# EAGLE schematic HydroSafeBattery (EAGLE 9.2.1)

## Sheet 1 of 3: Analog Front End (AFE)
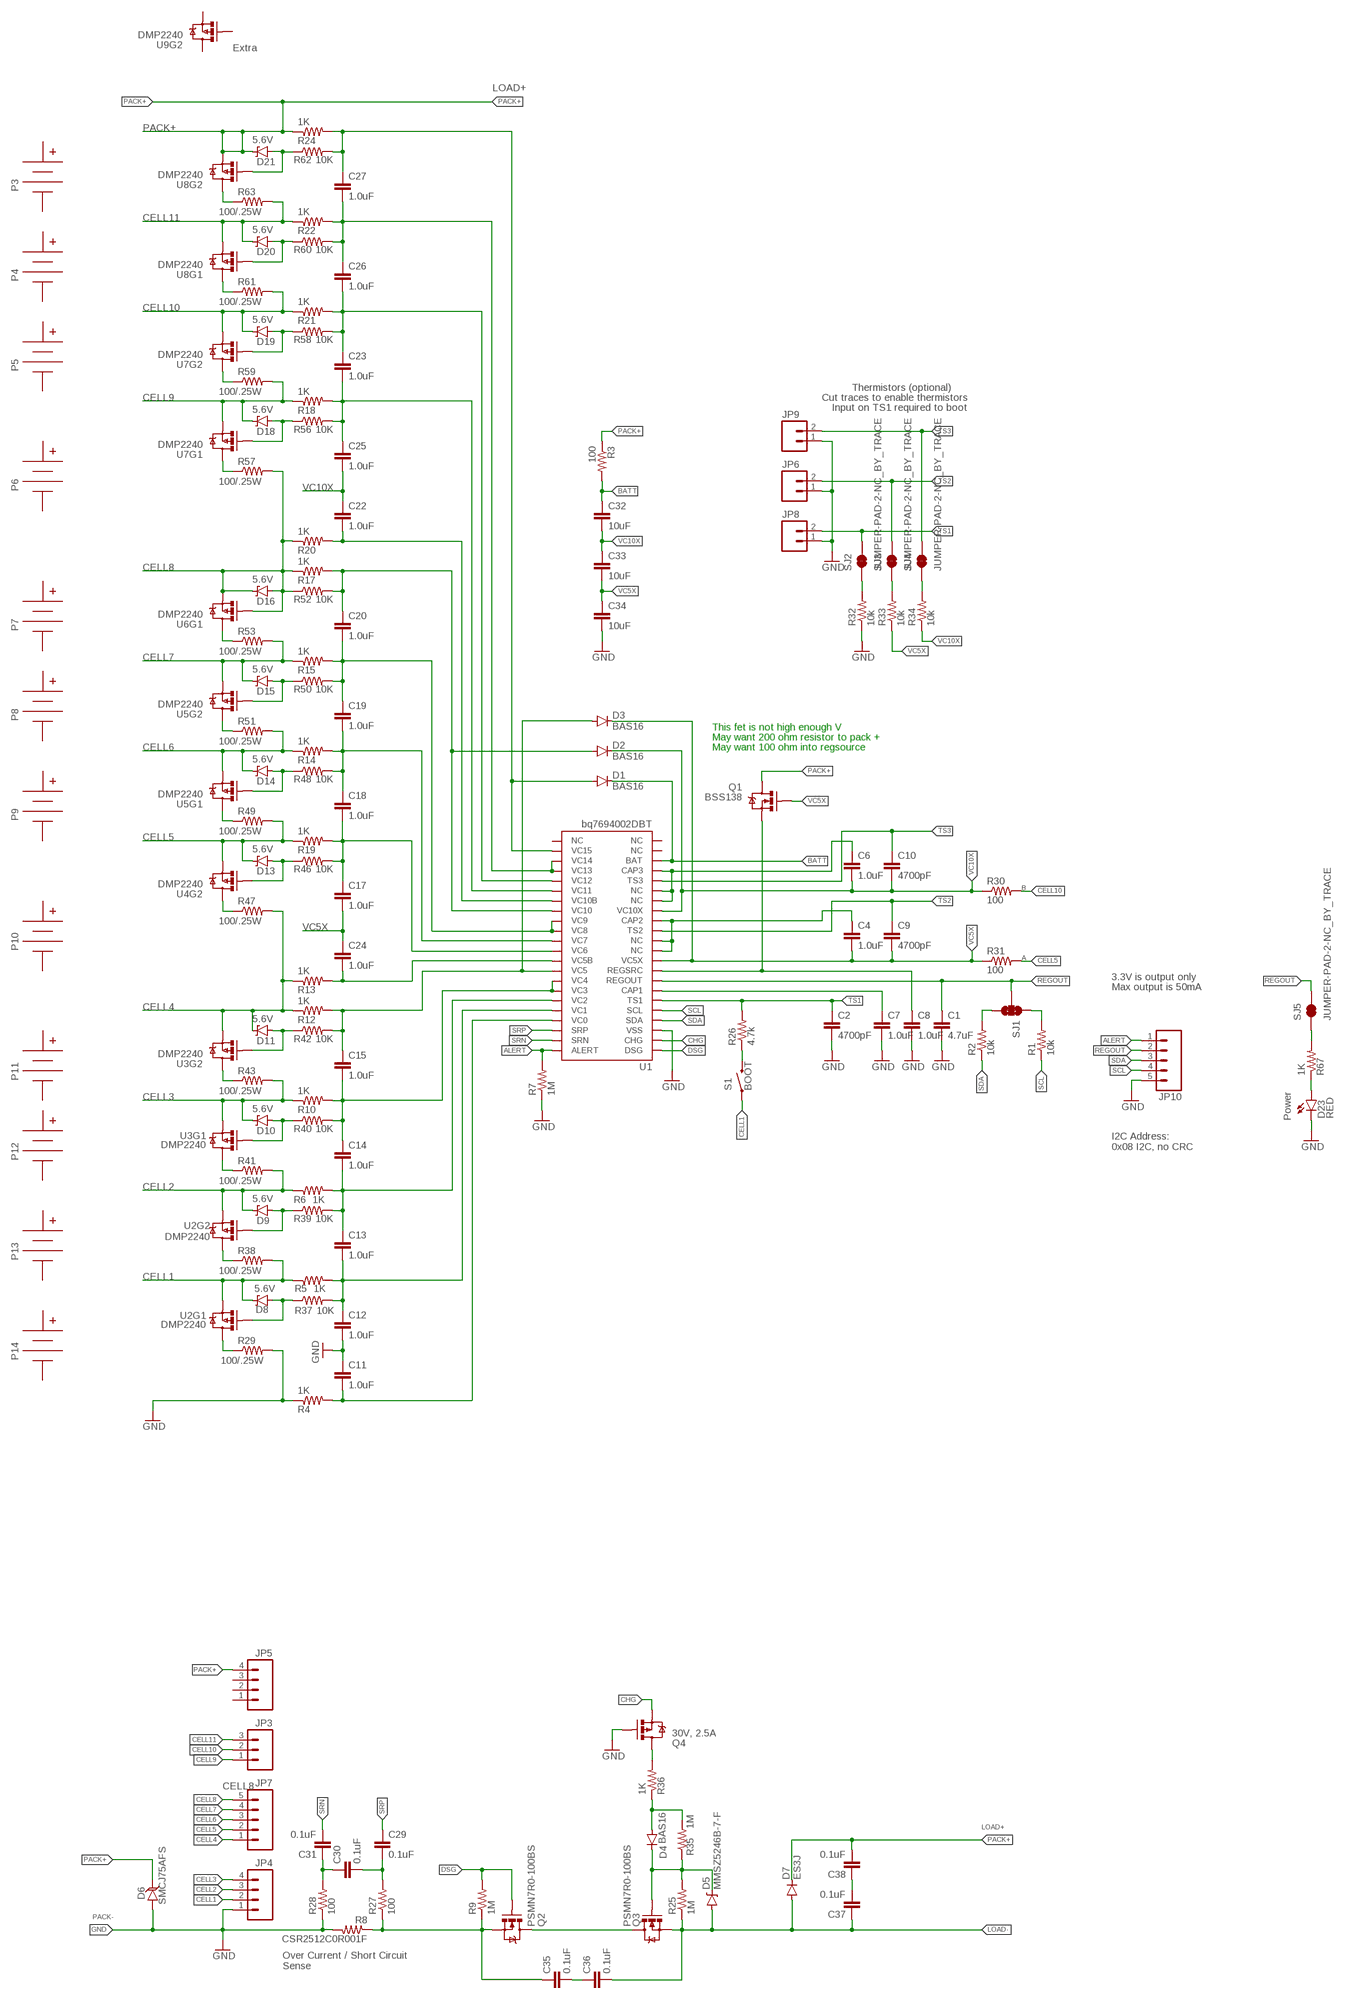
[diagram p0: schematic, sheet 1]

### Parts
C1  4.7uF  4.7UF-6.3V-10%(0603)0603  [0603-CAP@1]
C2  4700pF  4.7NF-50V-10%(0603)  [0603-CAP@1]
C4  1.0uF  1.0UF-16V-10%(0603)  [0603-CAP]
C6  1.0uF  1.0UF-16V-10%(0603)  [0603-CAP]
C7  1.0uF  1.0UF-16V-10%(0603)  [0603-CAP]
C8  1.0uF  1.0UF-16V-10%(0603)  [0603-CAP]
C9  4700pF  4.7NF-50V-10%(0603)  [0603-CAP@1]
C10  4700pF  4.7NF-50V-10%(0603)  [0603-CAP@1]
C11  1.0uF  1.0UF-16V-10%(0603)  [0603-CAP]
C12  1.0uF  1.0UF-16V-10%(0603)  [0603-CAP]
C13  1.0uF  1.0UF-16V-10%(0603)  [0603-CAP]
C14  1.0uF  1.0UF-16V-10%(0603)  [0603-CAP]
C15  1.0uF  1.0UF-16V-10%(0603)  [0603-CAP]
C17  1.0uF  1.0UF-16V-10%(0603)  [0603-CAP]
C18  1.0uF  1.0UF-16V-10%(0603)  [0603-CAP]
C19  1.0uF  1.0UF-16V-10%(0603)  [0603-CAP]
C20  1.0uF  1.0UF-16V-10%(0603)  [0603-CAP]
C22  1.0uF  1.0UF-16V-10%(0603)  [0603-CAP]
C23  1.0uF  1.0UF-16V-10%(0603)  [0603-CAP]
C24  1.0uF  1.0UF-16V-10%(0603)  [0603-CAP]
C25  1.0uF  1.0UF-16V-10%(0603)  [0603-CAP]
C26  1.0uF  1.0UF-16V-10%(0603)  [0603-CAP]
C27  1.0uF  1.0UF-16V-10%(0603)  [0603-CAP]
C29  0.1uF  0.1UF-25V(+80/-20%)(0603)  [0603-CAP@1]
C30  0.1uF  0.1UF-25V(+80/-20%)(0603)  [0603-CAP@1]
C31  0.1uF  0.1UF-25V(+80/-20%)(0603)  [0603-CAP@1]
C32  10uF  10UF50V20%(1210)  [1210]
C33  10uF  10UF50V20%(1210)  [1210]
C34  10uF  10UF50V20%(1210)  [1210]
C35  0.1uF  0.1UF-100V-10%(0603)  [0603-CAP@1]
C36  0.1uF  0.1UF-100V-10%(0603)  [0603-CAP@1]
C37  0.1uF  0.1UF-100V-10%(0603)  [0603-CAP@1]
C38  0.1uF  0.1UF-100V-10%(0603)  [0603-CAP@1]
D1  BAS16  DIODESOD  [SOD-323]
D2  BAS16  DIODESOD  [SOD-323]
D3  BAS16  DIODESOD  [SOD-323]
D4  BAS16  DIODESOD  [SOD-323]
D5  MMSZ5246B-7-F  DIODE-ZENERSOD-123  [SOD-123]
D6  SMCJ75AFS  TVSSMC  [SMC]
D7  ES3J  DIODESMC/DO-214AB  [SMC]
D8  5.6V  DIODE-ZENER3.3V  [SOD-323]
D9  5.6V  DIODE-ZENER3.3V  [SOD-323]
D10  5.6V  DIODE-ZENER3.3V  [SOD-323]
D11  5.6V  DIODE-ZENER3.3V  [SOD-323]
D13  5.6V  DIODE-ZENER3.3V  [SOD-323]
D14  5.6V  DIODE-ZENER3.3V  [SOD-323]
D15  5.6V  DIODE-ZENER3.3V  [SOD-323]
D16  5.6V  DIODE-ZENER3.3V  [SOD-323]
D18  5.6V  DIODE-ZENER3.3V  [SOD-323]
D19  5.6V  DIODE-ZENER3.3V  [SOD-323]
D20  5.6V  DIODE-ZENER3.3V  [SOD-323]
D21  5.6V  DIODE-ZENER3.3V  [SOD-323]
D23  RED  LED-RED1206  [LED-1206]
JP3  M03JST-PTH  [JST-3-PTH]
JP4  M04JST-PTH  [JST-4-PTH]
JP5  M04JST-PTH  [JST-4-PTH]
JP6  M02PTH  [1X02]
JP7  M05JST  [JST-5-PTH]
JP8  M02PTH  [1X02]
JP9  M02PTH  [1X02]
JP10  M05PTH  [1X05]
P3  18650_BAT_TRAY_SMD_NON_POLAR  [18650_BAT_TRAY_SMD_NON_POLAR]
P4  18650_BAT_TRAY_SMD_NON_POLAR  [18650_BAT_TRAY_SMD_NON_POLAR]
P5  18650_BAT_TRAY_SMD_NON_POLAR  [18650_BAT_TRAY_SMD_NON_POLAR]
P6  18650_BAT_TRAY_SMD_NON_POLAR  [18650_BAT_TRAY_SMD_NON_POLAR]
P7  18650_BAT_TRAY_SMD_NON_POLAR  [18650_BAT_TRAY_SMD_NON_POLAR]
P8  18650_BAT_TRAY_SMD_NON_POLAR  [18650_BAT_TRAY_SMD_NON_POLAR]
P9  18650_BAT_TRAY_SMD_NON_POLAR  [18650_BAT_TRAY_SMD_NON_POLAR]
P10  18650_BAT_TRAY_SMD_NON_POLAR  [18650_BAT_TRAY_SMD_NON_POLAR]
P11  18650_BAT_TRAY_SMD_NON_POLAR  [18650_BAT_TRAY_SMD_NON_POLAR]
P12  18650_BAT_TRAY_SMD_NON_POLAR  [18650_BAT_TRAY_SMD_NON_POLAR]
P13  18650_BAT_TRAY_SMD_NON_POLAR  [18650_BAT_TRAY_SMD_NON_POLAR]
P14  18650_BAT_TRAY_SMD_NON_POLAR  [18650_BAT_TRAY_SMD_NON_POLAR]
Q1  BSS138  MOSFET-NCHANNELBSS138  [SOT23-3]
Q2  PSMN7R0-100BS  MOSFET-NCHANNELPSMN7R0  [TO-263/D2PAK]
Q3  PSMN7R0-100BS  MOSFET-NCHANNELPSMN7R0  [TO-263/D2PAK]
Q4  30V, 2.5A  MOSFET-PCHANNELDMG2307L  [SOT23-3]
R1  10k  10KOHM1/10W1%(0603)0603  [0603-RES@1]
R2  10k  10KOHM1/10W1%(0603)0603  [0603-RES@1]
R3  100  100OHM1/10W1%(0603)  [0603-RES@1]
R4  1K  1KOHM1/10W1%(0603)  [0603-RES@1]
R5  1K  1KOHM1/10W1%(0603)  [0603-RES@1]
R6  1K  1KOHM1/10W1%(0603)  [0603-RES@1]
R7  1M  1MOHM1/10W1%(0603)  [0603-RES@1]
R8  CSR2512C0R001F  RESISTOR2512  [2512]
R9  1M  1MOHM1/10W1%(0603)  [0603-RES@1]
R10  1K  1KOHM1/10W1%(0603)  [0603-RES@1]
R12  1K  1KOHM1/10W1%(0603)  [0603-RES@1]
R13  1K  1KOHM1/10W1%(0603)  [0603-RES@1]
R14  1K  1KOHM1/10W1%(0603)  [0603-RES@1]
R15  1K  1KOHM1/10W1%(0603)  [0603-RES@1]
R17  1K  1KOHM1/10W1%(0603)  [0603-RES@1]
R18  1K  1KOHM1/10W1%(0603)  [0603-RES@1]
R19  1K  1KOHM1/10W1%(0603)  [0603-RES@1]
R20  1K  1KOHM1/10W1%(0603)  [0603-RES@1]
R21  1K  1KOHM1/10W1%(0603)  [0603-RES@1]
R22  1K  1KOHM1/10W1%(0603)  [0603-RES@1]
R24  1K  1KOHM1/10W1%(0603)  [0603-RES@1]
R25  1M  1MOHM1/10W1%(0603)  [0603-RES@1]
R26  4.7k  4.7KOHM1/10W1%(0603)  [0603-RES@1]
R27  100  100OHM1/10W1%(0603)  [0603-RES@1]
R28  100  100OHM1/10W1%(0603)  [0603-RES@1]
R29  100/.25W  100OHM1/10W1%(0603)  [0603-RES@1]
R30  100  100OHM1/10W1%(0603)  [0603-RES@1]
R31  100  100OHM1/10W1%(0603)  [0603-RES@1]
R32  10k  10KOHM1/10W1%(0603)0603  [0603-RES@1]
R33  10k  10KOHM1/10W1%(0603)0603  [0603-RES@1]
R34  10k  10KOHM1/10W1%(0603)0603  [0603-RES@1]
R35  1M  1MOHM1/10W1%(0603)  [0603-RES@1]
R36  1K  1KOHM1/10W1%(0603)  [0603-RES@1]
R37  10K  10KOHM1/10W1%(0603)0603  [0603-RES@1]
R38  100/.25W  100OHM1/10W1%(0603)  [0603-RES@1]
R39  10K  10KOHM1/10W1%(0603)0603  [0603-RES@1]
R40  10K  10KOHM1/10W1%(0603)0603  [0603-RES@1]
R41  100/.25W  100OHM1/10W1%(0603)  [0603-RES@1]
R42  10K  10KOHM1/10W1%(0603)0603  [0603-RES@1]
R43  100/.25W  100OHM1/10W1%(0603)  [0603-RES@1]
R46  10K  10KOHM1/10W1%(0603)0603  [0603-RES@1]
R47  100/.25W  100OHM1/10W1%(0603)  [0603-RES@1]
R48  10K  10KOHM1/10W1%(0603)0603  [0603-RES@1]
R49  100/.25W  100OHM1/10W1%(0603)  [0603-RES@1]
R50  10K  10KOHM1/10W1%(0603)0603  [0603-RES@1]
R51  100/.25W  100OHM1/10W1%(0603)  [0603-RES@1]
R52  10K  10KOHM1/10W1%(0603)0603  [0603-RES@1]
R53  100/.25W  100OHM1/10W1%(0603)  [0603-RES@1]
R56  10K  10KOHM1/10W1%(0603)0603  [0603-RES@1]
R57  100/.25W  100OHM1/10W1%(0603)  [0603-RES@1]
R58  10K  10KOHM1/10W1%(0603)0603  [0603-RES@1]
R59  100/.25W  100OHM1/10W1%(0603)  [0603-RES@1]
R60  10K  10KOHM1/10W1%(0603)0603  [0603-RES@1]
R61  100/.25W  100OHM1/10W1%(0603)  [0603-RES@1]
R62  10K  10KOHM1/10W1%(0603)0603  [0603-RES@1]
R63  100/.25W  100OHM1/10W1%(0603)  [0603-RES@1]
R67  1K  1KOHM1/10W1%(0603)  [0603-RES@1]
S1  BOOT  SWITCH-MOMENTARY-2-SMD-1101NE  [TACTILE-SWITCH-1101NE]
SJ1  JUMPER-PAD-3-NC_BY_TRACE  [PAD-JUMPER-3-3OF3_NC_BY_TRACE_YES_SILK_FULL_BOX]
SJ2  JUMPER-PAD-2-NC_BY_TRACE  [PAD-JUMPER-2-NC_BY_TRACE_YES_SILK]
SJ3  JUMPER-PAD-2-NC_BY_TRACE  [PAD-JUMPER-2-NC_BY_TRACE_YES_SILK]
SJ4  JUMPER-PAD-2-NC_BY_TRACE  [PAD-JUMPER-2-NC_BY_TRACE_YES_SILK]
SJ5  JUMPER-PAD-2-NC_BY_TRACE  [PAD-JUMPER-2-NC_BY_TRACE_YES_SILK]
U1  bq7694002DBT  BQ7694040  [44-TSSOP]
U2  DMP2240  MOSFET-PCHANNEL_DUALSOT26  [SOT26]
U3  DMP2240  MOSFET-PCHANNEL_DUALSOT26  [SOT26]
U4  DMP2240  MOSFET-PCHANNEL_DUALSOT26  [SOT26]
U5  DMP2240  MOSFET-PCHANNEL_DUALSOT26  [SOT26]
U6  DMP2240  MOSFET-PCHANNEL_DUALSOT26  [SOT26]
U7  DMP2240  MOSFET-PCHANNEL_DUALSOT26  [SOT26]
U8  DMP2240  MOSFET-PCHANNEL_DUALSOT26  [SOT26]
U9  DMP2240  MOSFET-PCHANNEL_DUALSOT26  [SOT26]

### Nets
ALERT: JP10.1 R7.2 U1.44(ALERT)
BATT: C32.1 D1.C R3.2 U1.20(BAT)
CAP2: C4.1 U1.11(NC) U1.12(NC) U1.14(CAP2)
CAP3: C6.1 U1.16(NC) U1.17(NC) U1.19(CAP3)
CELL1: D8.C JP4.2 R5.1 R38.2 S1.1 U2.S1(S)
CELL2: D9.C JP4.3 R6.1 R41.2 U2.S2(S)
CELL3: D10.C JP4.4 R10.1 R43.2 U3.S1(S)
CELL4: D11.C JP7.1 R12.1 R13.1 R47.2 U3.S2(S)
CELL5: D13.C JP7.2 R19.1 R31.2 R49.2 U4.S2(S)
CELL6: D14.C JP7.3 R14.1 R51.2 U5.S1(S)
CELL7: D15.C JP7.4 R15.1 R53.2 U5.S2(S)
CELL8: D16.A D16.C JP7.5 R17.1 R20.1 R52.1 R57.2 U6.G1(G) U6.S1(S)
CELL9: D18.C JP3.1 R18.1 R59.2 U7.S1(S)
CELL10: D19.C JP3.2 R21.1 R30.2 R61.2 U7.S2(S)
CELL11: D20.C JP3.3 R22.1 R63.2 U8.S1(S)
CHG: Q4.2(S) U1.2(CHG)
CHG_CTL: D4.C D5.C Q3.1(G) R25.2 R35.1
DSG: Q2.1(G) R9.2 U1.1(DSG)
GND: C1.2 C2.2 C7.2 C8.2 C11.1 C12.2 C34.2 D6.A D23.C JP4.1 JP6.1 JP8.1 JP9.1 JP10.5 Q4.1(G) R4.1 R7.1 R8.2 R28.1 R29.2 R32.1 U1.3(VSS) ; also sheet 2,3
LOAD1: Q2.2(D) Q3.2(D)
LOAD2: C35.1 Q2.3(S) R8.1 R9.1 R27.1
LOAD-: C36.2 C37.1 D5.A D7.A Q3.3(S) R25.1
N$1: D8.A R37.1 U2.G1(G)
N$2: Q4.3(D) R36.2
N$3: R32.2 SJ2.1
N$4: R29.1 U2.D1(D)
N$5: D9.A R39.1 U2.G2(G)
N$6: C35.2 C36.1
N$7: D4.A R35.2 R36.1
N$8: R38.1 U2.D2(D)
N$9: C37.2 C38.1
N$10: R2.2 SJ1.3
N$11: R1.2 SJ1.1
N$12: D10.A R40.1 U3.G1(G)
N$13: R41.1 U3.D1(D)
N$14: D11.A R42.1 U3.G2(G)
N$16: R43.1 U3.D2(D)
N$17: C26.1 C27.2 R22.2 R60.2 U1.25(VC14) U1.26(VC13)
N$20: D13.A R46.1 U4.G2(G)
N$21: R47.1 U4.D2(D)
N$23: R49.1 U5.D1(D)
N$25: D14.A R48.1 U5.G1(G)
N$26: R51.1 U5.D2(D)
N$27: D15.A R50.1 U5.G2(G)
N$28: R33.2 SJ3.1
N$30: C7.1 U1.7(CAP1)
N$32: R26.1 S1.2
N$33: R34.2 SJ4.1
N$34: C29.2 C30.2 R27.2
N$35: C30.1 C31.1 R28.2
N$37: R53.1 U6.D1(D)
N$42: D18.A R56.1 U7.G1(G)
N$43: R57.1 U7.D1(D)
N$44: D19.A R58.1 U7.G2(G)
N$46: R59.1 U7.D2(D)
N$47: D20.A R60.1 U8.G1(G)
N$50: R61.1 U8.D1(D)
N$51: D21.A R62.1 U8.G2(G)
N$52: R63.1 U8.D2(D)
N$57: D23.A R67.1
N$58: R67.2 SJ5.1
PACK+: C38.2 D6.C D7.C D21.C JP5.4 Q1.3(D) R3.1 R24.1 U8.S2(S)
REGOUT: C1.1 JP10.2 SJ1.2 SJ5.2 U1.8(REGOUT)
REGSRC: C8.1 Q1.2(S) U1.9(REGSRC)
SCL: JP10.4 R1.1 U1.5(SCL)
SDA: JP10.3 R2.1 U1.4(SDA)
SRN: C31.2 U1.43(SRN)
SRP: C29.1 U1.42(SRP)
TS1: C2.1 JP8.2 R26.2 SJ2.2 U1.6(TS1)
TS2: C9.1 JP6.2 SJ3.2 U1.13(TS2)
TS3: C10.1 JP9.2 SJ4.2 U1.18(TS3)
VC0: C11.2 R4.2 U1.41(VC0)
VC1: C12.1 C13.2 R5.2 R37.2 U1.40(VC1)
VC2: C13.1 C14.2 R6.2 R39.2 U1.39(VC2)
VC4: C14.1 C15.2 R10.2 R40.2 U1.37(VC4) U1.38(VC3)
VC5: C15.1 D3.A R12.2 R42.2 U1.36(VC5)
VC5B: C24.2 R13.2 U1.35(VC5B)
VC5X: C4.2 C9.2 C17.2 C24.1 C33.2 C34.1 D3.C Q1.1(G) R31.1 R33.1 U1.10(VC5X)
VC6: C17.1 C18.2 R19.2 R46.2 U1.34(VC6)
VC7: C18.1 C19.2 R14.2 R48.2 U1.33(VC7)
VC8: C19.1 C20.2 R15.2 R50.2 U1.31(VC9) U1.32(VC8)
VC10: C20.1 D2.A R17.2 R52.2 U1.30(VC10)
VC10B: C22.2 R20.2 U1.29(VC10B)
VC10X: C6.2 C10.2 C22.1 C25.2 C32.2 C33.1 D2.C R30.1 R34.1 U1.15(VC10X)
VC11: C23.2 C25.1 R18.2 R56.2 U1.28(VC11)
VC12: C23.1 C26.2 R21.2 R58.2 U1.27(VC12)
VC13: C27.1 D1.A R24.2 R62.2 U1.24(VC15)
Unconnected: JP5.1 JP5.2 JP5.3 P3.P$1(V-) P3.P$2(V+) P4.P$1(V-) P4.P$2(V+) P5.P$1(V-) P5.P$2(V+) P6.P$1(V-) P6.P$2(V+) P7.P$1(V-) P7.P$2(V+) P8.P$1(V-) P8.P$2(V+) P9.P$1(V-) P9.P$2(V+) P10.P$1(V-) P10.P$2(V+) P11.P$1(V-) P11.P$2(V+) P12.P$1(V-) P12.P$2(V+) P13.P$1(V-) P13.P$2(V+) P14.P$1(V-) P14.P$2(V+) U1.21(NC) U1.22(NC) U1.23(NC) U4.D1(D) U4.G1(G) U4.S1(S) U6.D2(D) U6.G2(G) U6.S2(S) U9.D1(D) U9.D2(D) U9.G1(G) U9.G2(G) U9.S1(S) U9.S2(S)

### Notes on the sheet
- Extra
- LOAD+
- Thermistors (optional)
- Cut traces to enable thermistors
- Input on TS1 required to boot
- This fet is not high enough V
- May want 200 ohm resistor to pack +
- May want 100 ohm into regsource
- B
- A
- 3.3V is output only
- Max output is 50mA
- Power
- I2C Address:
  0x08 I2C, no CRC
- LOAD+
- PACK-
- Over Current / Short Circuit
  Sense

## Sheet 2 of 3: GUAGE AND PRECHARGE
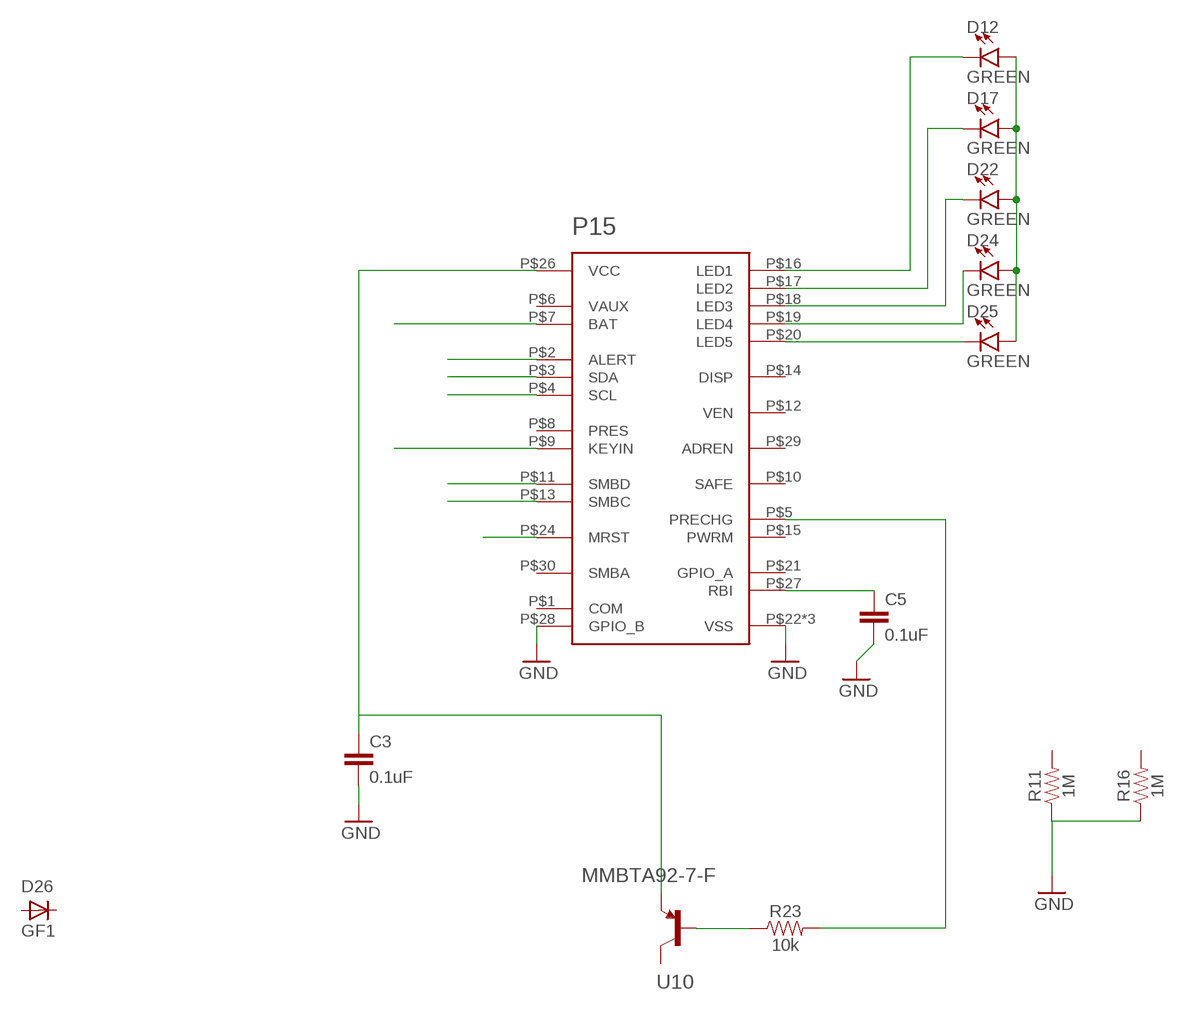
[diagram p1: schematic, sheet 2]

### Parts
C3  0.1uF  0.1UF-0603-100V-10%  [0603]
C5  0.1uF  0.1UF-0603-100V-10%  [0603]
D12  GREEN  LED-GREEN1206  [LED-1206]
D17  GREEN  LED-GREEN1206  [LED-1206]
D22  GREEN  LED-GREEN1206  [LED-1206]
D24  GREEN  LED-GREEN1206  [LED-1206]
D25  GREEN  LED-GREEN1206  [LED-1206]
D26  GF1  [SMA-DO214AC]
P15  BQ78350-R1  [TSSOP-30]
R11  1M  1MOHM-0603-1/4W-5%  [0603]
R16  1M  1MOHM-0603-1/4W-5%  [0603]
R23  10k  10KOHM-0603-1/10W-1%  [0603]
U10  MMBTA92-7-F  [SOT-23]

### Nets
GND: C3.2 C5.2 P15.P$22(VSS) P15.P$23(VSS) P15.P$25(VSS) P15.P$28(GPIO_B) ; also sheet 1,3
N$19: D25.C P15.P$20(LED5)
N$22: D24.C P15.P$19(LED4)
N$24: D22.C P15.P$18(LED3)
N$29: D17.C P15.P$17(LED2)
N$31: D12.C P15.P$16(LED1)
N$36: D12.A D17.A D22.A D24.A D25.A
N$38: P15.P$13(SMBC)
N$39: P15.P$11(SMBD)
N$40: P15.P$2(ALERT)
N$41: C5.1 P15.P$27(RBI)
N$45: P15.P$3(SDA)
N$48: P15.P$4(SCL)
N$49: P15.P$7(BAT)
N$53: P15.P$9(KEYIN)
N$54: P15.P$24(MRST)
N$55: R11.1 R16.1 ; supply symbol labelled GND
N$56: P15.P$5(PRECHG) R23.2
N$59: R23.1 U10.1(B)
N$60: C3.1 P15.P$26(VCC) U10.2(E)
Unconnected: D26.A D26.K(C) P15.P$1(COM) P15.P$6(VAUX) P15.P$8(PRES) P15.P$10(SAFE) P15.P$12(VEN) P15.P$14(DISP) P15.P$15(PWRM) P15.P$21(GPIO_A) P15.P$29(ADREN) P15.P$30(SMBA) R11.2 R16.2 U10.3(C)

## Sheet 3 of 3: PROGRAMMING COMMS
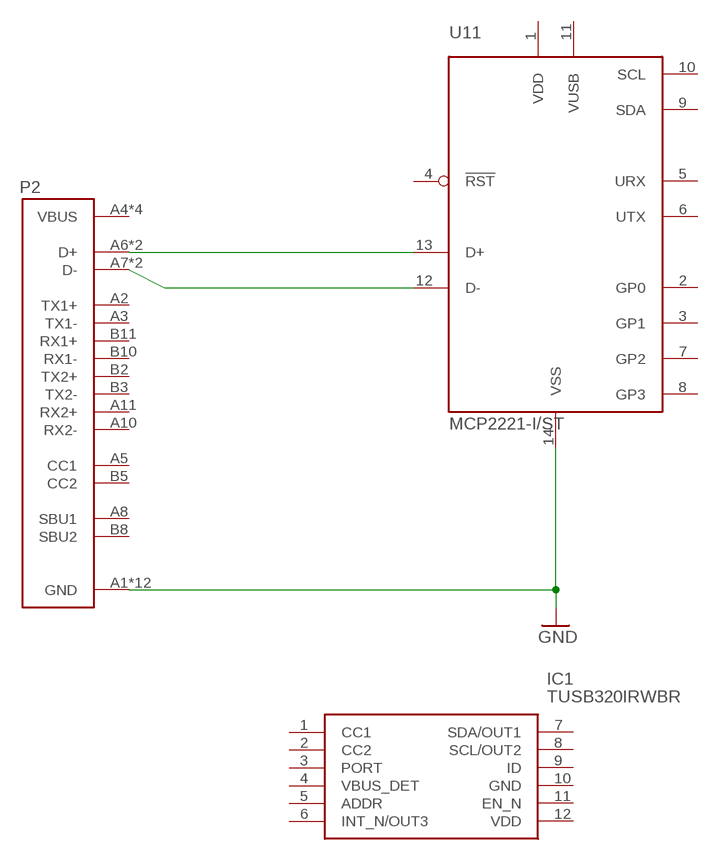
[diagram p2: schematic, sheet 3]

### Parts
IC1  TUSB320IRWBR  [RWB0012A]
P2  1054500101  [USB_C_MOLEX_TOP_MOUNT]
U11  MCP2221-I/ST  [TSSOP14]

### Nets
GND: P2.A1(GND) P2.A12(GND) P2.B1(GND) P2.B12(GND) P2.SHIELD1(GND) P2.SHIELD2(GND) P2.SHIELD3(GND) P2.SHIELD4(GND) P2.SHIELDB1(GND) P2.SHIELDB2(GND) P2.SHIELDB3(GND) P2.SHIELDB4(GND) U11.14(VSS) ; also sheet 1,2
N$15: P2.A6(D+) P2.B6(D+) U11.13(D+)
N$18: P2.A7(D-) P2.B7(D-) U11.12(D-)
Unconnected: IC1.1(CC1) IC1.2(CC2) IC1.3(PORT) IC1.4(VBUS_DET) IC1.5(ADDR) IC1.6(INT_N/OUT3) IC1.7(SDA/OUT1) IC1.8(SCL/OUT2) IC1.9(ID) IC1.10(GND) IC1.11(EN_N) IC1.12(VDD) P2.A2(TX1+) P2.A3(TX1-) P2.A4(VBUS) P2.A5(CC1) P2.A8(SBU1) P2.A9(VBUS) P2.A10(RX2-) P2.A11(RX2+) P2.B2(TX2+) P2.B3(TX2-) P2.B4(VBUS) P2.B5(CC2) P2.B8(SBU2) P2.B9(VBUS) P2.B10(RX1-) P2.B11(RX1+) U11.2(GP0) U11.3(GP1) U11.4(!RST) U11.5(URX) U11.6(UTX) U11.7(GP2) U11.8(GP3) U11.9(SDA) U11.10(SCL)

## Power pins joined to a net without a drawn wire
VDD: U11.1(VDD)
VUSB: U11.11(VUSB)

## Library data of the parts
C1 = SparkFun-Capacitors:4.7UF-6.3V-10%(0603): CAP-08280; PROD_ID: CAP-08280
C2 C9 C10 = SparkFun-Capacitors:4.7NF-50V-10%(0603): CAP-11378; PROD_ID: CAP-11378; VALUE: 4.7nF
C3 C5 = SparkFun-Capacitors:0.1UF: 0.1µF ceramic capacitors A capacitor is a passive two-terminal electrical component used to store electrical energy temporarily in an electric field.; PROD_ID: CAP-08390
C4 C6-C8 C11-C15 C17-C20 C22-C27 = SparkFun-Capacitors:1.0UF-16V-10%(0603): CAP-00868; PROD_ID: CAP-00868
C29-C31 = SparkFun-Capacitors:0.1UF-25V(+80/-20%)(0603): CAP-00810 Ceramic Standard decoupling cap; PROD_ID: CAP-00810
C32-C34 = SparkFun-Capacitors:10UF50V20%(1210): CAP-09824; PROD_ID: CAP-09824
C35-C38 = SparkFun-Capacitors:0.1UF-100V-10%(0603): CAP-08390; PROD_ID: CAP-08390
D1-D4 = SparkFun-DiscreteSemi:DIODE: Diode These are standard reverse protection diodes and small signal diodes. SMA package can handle up to about 1A. SOD-323 can handle about 200mA. What the SOD-323 package when ordering, there are some mfgs out there that are 5-pin packages.; PROD_ID: DIO-09646
D5 = SparkFun-DiscreteSemi:DIODE-ZENER: Zener Diode Production Part - 8199 3.4V Zener Voltage
D6 = SparkFun-DiscreteSemi:TVS: Transient voltage suppressor- prevents ESD on inputs.
D7 = SparkFun-DiscreteSemi:DIODE: Diode These are standard reverse protection diodes and small signal diodes. SMA package can handle up to about 1A. SOD-323 can handle about 200mA. What the SOD-323 package when ordering, there are some mfgs out there that are 5-pin packages.
D8-D11 D13-D16 D18-D21 = SparkFun-DiscreteSemi:DIODE-ZENER: Zener Diode Production Part - 8199 3.4V Zener Voltage; PROD_ID: DIO-11284; VALUE: 3.3V
D12 D17 D22 D24 D25 = SparkFun-LED:LED-GREEN: Green SMD LED Used in manufacturing of various products at SparkFun Packages: 0603 - SMD 0603 package [Product Link] <http://www.futureelectronics.com/en/technologies/semiconductors/optoelectronics/leds/Pages/9894312-LTST-C190GKT.aspx?CrossPart=HSMG-C190&IM=0> LilyPad 1206 - SMD1206 LilyPad package [Product Link] <http://www.futureelectronics.com/en/Technologies/Product.aspx?ProductID=IN150NGHARVATEKCORPORATION2049943&IM=0> 1206 - SMD1206 package [Product Link] <http://www.futureelectronics.com/en/technologies/semiconductors/optoelectronics/leds/Pages/8315665-LTST-C150KGKT.aspx?IM=0> 1206 Bottom Mount -SMD 1206 Bottom Mount [Product Link] <http://www.digikey.com/product-detail/en/lite-on-inc/LTST-C230KGKT/160-1456-1-ND/386854> SparkFun Products: Pro Mini 328 -5V <https://www.sparkfun.com/products/821> RedBoard <https://www.sparkfun.com/products/12757> MP3 Trigger <https://www.sparkfun.com/products/13720> Makey Makey <https://www.sparkfun.com/products/11076>; PROD_ID: DIO-00862
D23 = SparkFun-LED:LED-RED: Assorted Red LEDs LilyPad 1206- DIO-09912 1206- DIO-00809 0603- DIO-00819 "SMART" means more efficient and expensive; PROD_ID: DIO-09912
D26 = diode:GF1: DIODE
IC1 = TUSB320IRWBR:TUSB320IRWBR: USB Interface IC TUSB320 USB Type-C Config Channel Logic Source: Datasheet <http://www.ti.com/lit/ds/symlink/tusb320.pdf>; DESCRIPTION: USB Interface IC TUSB320 USB Type-C Config Channel Logic; HEIGHT: mm; MANUFACTURER_NAME: Texas Instruments; MANUFACTURER_PART_NUMBER: TUSB320IRWBR; MOUSER_PART_NUMBER: 595-TUSB320IRWBR
JP3 = SparkFun-Connectors:M03: Header 3 Standard 3-pin 0.1" header. Use with straight break away headers (SKU : PRT-00116), right angle break away headers (PRT-00553), swiss pins (PRT-00743), machine pins (PRT-00117), and female headers (PRT-00115). Molex polarized connector foot print use with SKU : PRT-08232 with associated crimp pins and housings.; SKU: PRT-09915
JP4 JP5 = SparkFun-Connectors:M04: Header 4 Standard 4-pin 0.1" header. Use with straight break away headers (SKU : PRT-00116), right angle break away headers (PRT-00553), swiss pins (PRT-00743), machine pins (PRT-00117), and female headers (PRT-00115). Molex polarized connector foot print use with SKU : PRT-08231 with associated crimp pins and housings. 1MM SMD Version SKU: PRT-10208; SKU: PRT-09916
JP6 JP8 JP9 = SparkFun-Connectors:M02: Standard 2-pin 0.1" header. Use with - straight break away headers ( PRT-00116) - right angle break away headers (PRT-00553) - swiss pins (PRT-00743) - machine pins (PRT-00117) - female headers (PRT-00115) Molex polarized connector foot print use with: PRT-08233 with associated crimp pins and housings. 2.54_SCREWTERM for use with PRT-10571. 3.5mm Screw Terminal footprints for PRT-08084 5mm Screw Terminal footprints for use with PRT-08432
JP7 JP10 = SparkFun-Connectors:M05: Header 5 Standard 5-pin 0.1" header. Use with straight break away headers (SKU : PRT-00116), right angle break away headers (PRT-00553), swiss pins (PRT-00743), machine pins (PRT-00117), and female headers (PRT-00115). Molex polarized connector foot print use with SKU : PRT-08230 with associated crimp pins and housings.
P2 = 1054500101:1054500101
P3-P14 = Hydronalix:18650_BAT_TRAY_SMD_NON_POLAR
P15 = Hydronalix:BQ78350-R1
Q1 = SparkFun-DiscreteSemi:MOSFET-NCHANNEL: Common NMOSFET Parts MFG P/N Store ID Prod ID FDD8780 TRANS-09984 SI7820DN TRANS-11055 FDS6630A IC-08089 2N7002PW TRANS-11151 FQP30N06L COM-10213 TRANS-10060 BSS123LT1G TRANS-08345 BSS138 TRANS-00830 BS170 2N7000; PROD_ID: TRANS-00830
Q2 Q3 = SparkFun-DiscreteSemi:MOSFET-NCHANNEL: Common NMOSFET Parts MFG P/N Store ID Prod ID FDD8780 TRANS-09984 SI7820DN TRANS-11055 FDS6630A IC-08089 2N7002PW TRANS-11151 FQP30N06L COM-10213 TRANS-10060 BSS123LT1G TRANS-08345 BSS138 TRANS-00830 BS170 2N7000
Q4 = SparkFun-DiscreteSemi:MOSFET-PCHANNEL: Generic PMOSFET IRLML2244 - TRANS-11153 (SOT-23 -20V -4.3A) (1.Gate 2.Source 3.Drain) FQP27P06 - COM-10349 <http://www.sparkfun.com/products/10349> (TO-220 -60V -27A) (1.Gate 2.Source 3.Drain); PROD_ID: TRANS-11308
R1 R2 R32-R34 = SparkFun-Resistors:10KOHM1/10W1%(0603): RES-00824; PROD_ID: RES-00824; VALUE: 10K
R3 R27 R28 R30 R31 = SparkFun-Resistors:100OHM1/10W1%(0603): RES-07863; PROD_ID: RES-07863
R4-R6 R10 R12-R15 R17-R22 R24 R36 R67 = SparkFun-Resistors:1KOHM1/10W1%(0603): RES-07856; PROD_ID: RES-07856
R7 R9 R25 R35 = SparkFun-Resistors:1MOHM1/10W1%(0603): RES-07868; PROD_ID: RES-07868
R8 = bq769x0:RESISTOR
R11 R16 = SparkFun-Resistors:1MOHM: 1MΩ resistor A resistor is a passive two-terminal electrical component that implements electrical resistance as a circuit element. Resistors act to reduce current flow, and, at the same time, act to lower voltage levels within circuits. - Wikipedia; PROD_ID: RES-07868
R23 = SparkFun-Resistors:10KOHM: 10kΩ resistor A resistor is a passive two-terminal electrical component that implements electrical resistance as a circuit element. Resistors act to reduce current flow, and, at the same time, act to lower voltage levels within circuits. - Wikipedia; PROD_ID: RES-00824
R26 = SparkFun-Resistors:4.7KOHM1/10W1%(0603): RES-07857; PROD_ID: RES-07857; VALUE: 4.7K
R29 R38 R41 R43 R47 R49 R51 R53 R57 R59 R61 R63 = SparkFun-Resistors:100OHM1/10W1%(0603): RES-07863; PROD_ID: RES-07863; VALUE: 100
R37 R39 R40 R42 R46 R48 R50 R52 R56 R58 R60 R62 = SparkFun-Resistors:10KOHM1/10W1%(0603): RES-00824; PROD_ID: RES-00824
S1 = SparkFun-Electromechanical:SWITCH-MOMENTARY-2: Various NO switches- pushbuttons, reed, etc
SJ1 = SparkFun-Passives:JUMPER-PAD-3-NC_BY_TRACE
SJ2-SJ5 = SparkFun-Passives:JUMPER-PAD-2-NC_BY_TRACE
U1 = bq769x0:BQ76940: Description: bq769x0 from TI is a multi-cell battery monitoring chipset. It's fairly complex but has lots of useful features. Currently footprint and symbol are unproven.
U2-U9 = SparkFun-DiscreteSemi:MOSFET-PCHANNEL_DUAL
U10 = MMBTA92-7-F:MMBTA92-7-F: 300V PNP small signal transistor in SOT23; MANUFACTURER_PART_NUMBER: MMBTA927F; VENDOR: Diodes Inc
U11 = microchip-mcp2221:MCP2221-*: MCP2221 in PDIP, SOIC and TSSOP package The MCP2221 is a USB-to-UART/I2C serial converter which enables USB connectivity in applications that have a UART and I2C interfaces. The device reduces external components by integrating the USB termination resistors and the oscillator needed for USB operation. The MCP2221 also has four GP pins providing miscellaneous functionalities (GPIO, USBCFG, SSPND, Clock Output, ADC, DAC, interrupt detector). Source: www.microchip.com/MCP2221 <http://www.microchip.com/wwwproducts/Devices.aspx?product=MCP2221> and www.microchipdirect.com <http://www.microchipdirect.com/ProductDetails.aspx?Category=MCP2221> Tutorial: MCP2221 by Arnauld Biganzoli <https://docs.google.com/document/d/1P3zzqCKdEXzCe--1Yyg8PClCZKsUri8pyNO7AV2daaw/edit?usp=sharing>